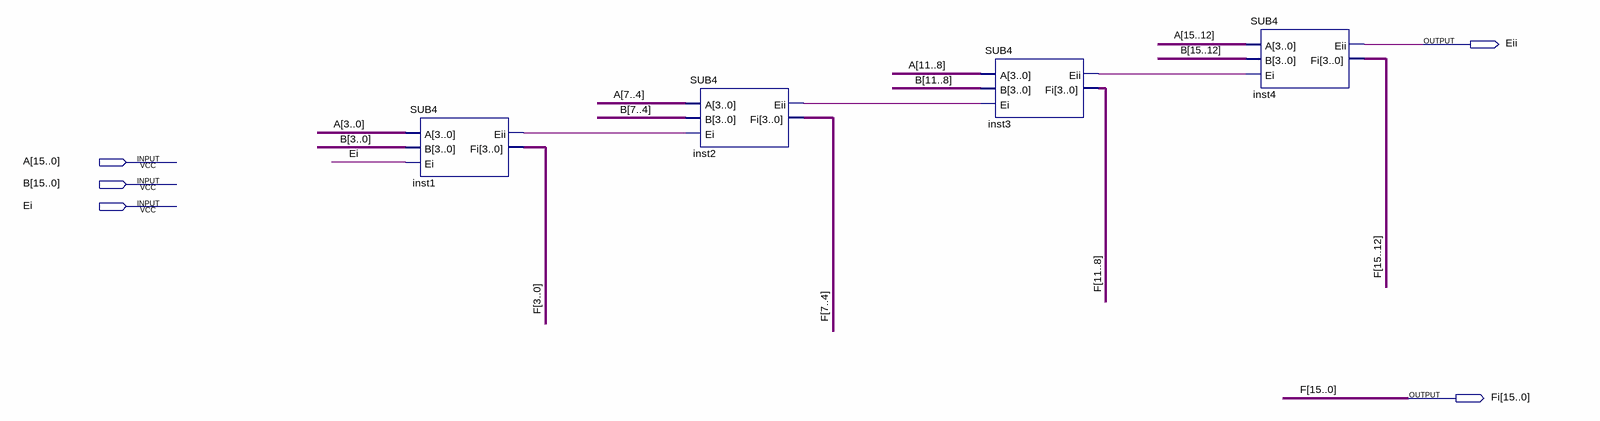
[diagram p0: schematic sheet]
// Quartus schematic SUB16.bdf as structural Verilog: 4 symbols, 5 pins
module SUB16 (
  input  [15:0] A,
  input  [15:0] B,
  input  Ei,
  output Eii,
  output [15:0] Fi
);

  wire inst1_eii, inst2_eii, inst3_eii;

  SUB4 inst1 (.A(A[3:0]), .B(B[3:0]), .Ei(Ei), .Eii(inst1_eii), .Fi(Fi[3:0]));
  SUB4 inst2 (.A(A[7:4]), .B(B[7:4]), .Ei(inst1_eii), .Eii(inst2_eii), .Fi(Fi[7:4]));
  SUB4 inst3 (.A(A[11:8]), .B(B[11:8]), .Ei(inst2_eii), .Eii(inst3_eii), .Fi(Fi[11:8]));
  SUB4 inst4 (.A(A[15:12]), .B(B[15:12]), .Ei(inst3_eii), .Eii(Eii), .Fi(Fi[15:12]));

  // Other names for the same wires on the sheet: F[15:0] = Fi
endmodule
